# EAGLE design AlimTeleinfoMySensors (EAGLE 7.5.0)
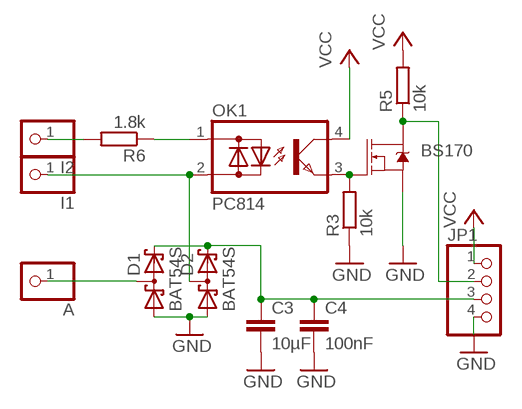
[diagram p0: schematic, sheet 1]

## Parts
A  PINHD-1X1  [1X01]
BS170  MOSFET-NCH-BSS138  [SOT23-3]
C3  10µF  C-EUC1210  [C1210]
C4  100nF  C-EUC1206  [C1206]
D1  BAT54S  [SOT23]
D2  BAT54S  [SOT23]
I1  PINHD-1X1  [1X01]
I2  PINHD-1X1  [1X01]
JP1  PINHD-1X4  [1X04]
OK1  PC814  [DIL04]
R3  10k  R-EU_M1206  [M1206]
R5  10k  R-EU_M1206  [M1206]
R6  1.8k  R-EU_M1206  [M1206]

## Nets
GND: BS170.2(S) C3.2 C4.2 D1.1(A1) D2.1(A1) JP1.4 R3.1
N$8: I2.1 R6.2
N$9: D2.3(C1A2) I1.1 OK1.2(AC2)
N$10: BS170.3(D) JP1.2 R5.1
N$11: C3.1 C4.1 D1.2(C2) D2.2(C2) JP1.3
N$13: OK1.1(AC1) R6.1
N$14: BS170.1(G) OK1.3(E) R3.2
N$15: A.1 D1.3(C1A2)
VCC: JP1.1 OK1.4(C) R5.2

## Library data of the parts
A I1 I2 = pinhead:PINHD-1X1: PIN HEADER
BS170 = SparkFun-DiscreteSemi:MOSFET-NCH: N-channel MOSFETs Voltage controlled devices that allow control of high current outputs. SparkFun Products: SparkFun OpenScale <https://www.sparkfun.com/products/13261> SparkFun Digital Sandbox <https://www.sparkfun.com/products/12651> SparkFun Monster Moto Shield <https://www.sparkfun.com/products/10182> SparkFun MOSFET Power Controller <https://www.sparkfun.com/products/11214>; PROD_ID: TRANS-00830; VALUE: 220mA/50V/3.5Ω
C3 C4 = rcl:C-EU: CAPACITOR, European symbol
D1 D2 = diode:BAT54S: Schottky Diodes Pin connection corrected 2011-05-04 Source: Fairchild .. BAT54.pdf
JP1 = pinhead:PINHD-1X4: PIN HEADER
OK1 = optocoupler:PC814: SHARP OPTO COUPLER; OC_FARNELL: 9707662; OC_NEWARK: unknown
R3 R5 R6 = rcl:R-EU_: RESISTOR, European symbol

## Board
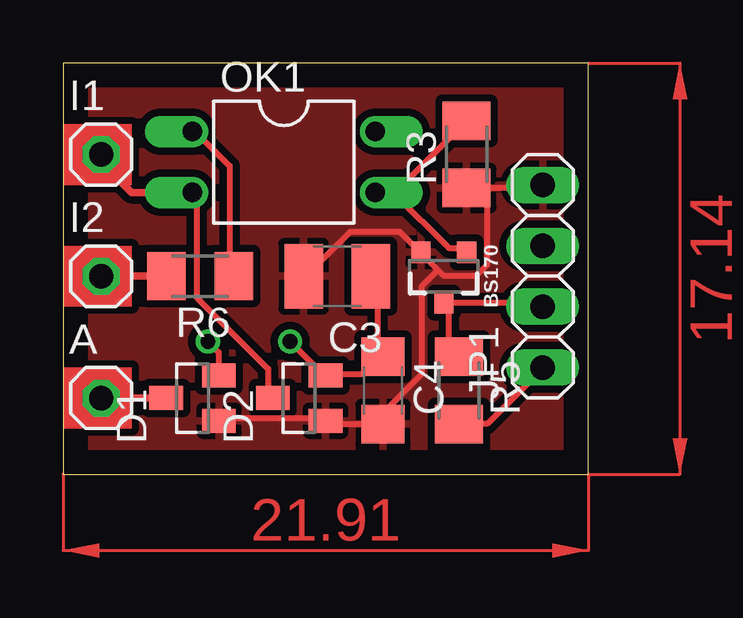
[diagram p1: board, top side]
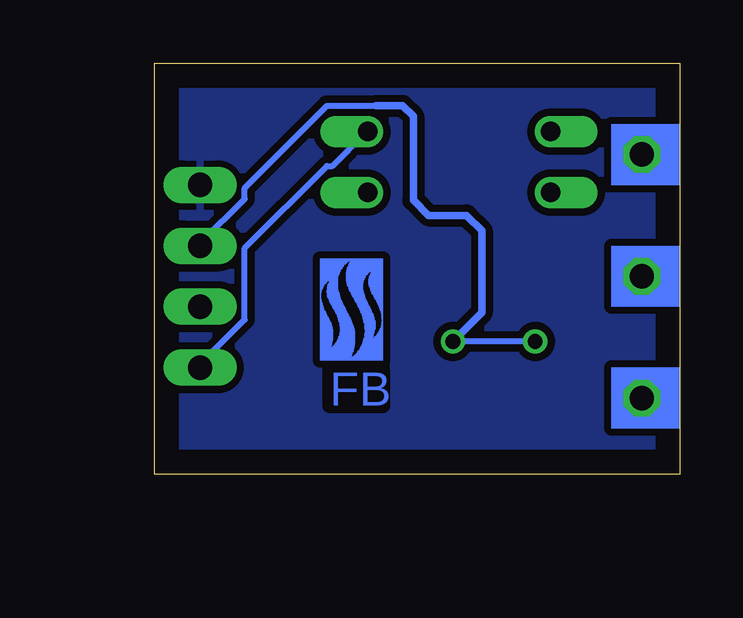
[diagram p2: board, bottom side, seen from below]

Size 21.89 x 17.13 mm. Coordinates in mm from the lower left corner, seen from the top.
Outline: 0,0 21.9,0 21.9,17.13 0,17.13 0,0
Copper layers (1*16): Top 0.035mm / dielectric 1.5mm / Bottom 0.035mm
Design rules "default": minimum track width 10mil, minimum drill 24mil, track to track 8mil, track to pad 8mil, pad to pad 8mil, via to via 8mil, smd to smd 8mil, copper to edge 40mil, drill to drill 8mil, minimum pad ring 10mil, minimum via ring 8mil, stop-mask expansion 4mil, vias tented up to drill 0mil, thermal gap 10mil

### Footprints (pad centres in the part's own frame; a part is rotated, then mirrored left to right if it is on the bottom)
1X01 = drill 1.016 octagon: 1 0,0
SOT23-3 = smd 0.8 x 0.9: 1 -0.95,-1; 2 0.95,-1; 3 0,1.1
C1210 = smd 1.6 x 2.7: 1 -1.4,0; 2 1.4,0
C1206 = smd 1.6 x 1.8: 1 -1.4,0; 2 1.4,0
SOT23 = smd 1 x 1.4: 1 -0.95,-1.1; 2 0.95,-1.1; 3 0,1.1
1X04 = drill 1.016 long: 1 -3.81,0; 2 -1.27,0; 3 1.27,0; 4 3.81,0
DIL04 = drill 0.813 offset: 1 -1.27,-3.81; 2 1.27,-3.81; 3 1.27,3.81; 4 -1.27,3.81
M1206 = smd 1.6 x 2: 1 -1.4,0; 2 1.4,0

### Placement (x,y rotation side)
A  1.59,3.17 0 top
BS170  15.88,8.26 180 top
C3  11.43,8.26 180 top
C4  13.34,3.49 270 top
D1  5.4,3.17 90 top
D2  9.84,3.17 90 top
I1  1.59,13.34 0 top
I2  1.59,8.26 0 top
JP1  20,8.26 90 top
OK1  9.21,13.02 270 top
R3  16.83,13.34 90 top
R5  16.51,3.49 270 top
R6  5.71,8.26 180 top
U$1  [FB]  12.38,4.76 0 top

### Tracks (layer width: path | path; a pad name or v marks a point on that pad's centre or on a via)
GND
  Top 0.254: D1.1 6.72,2.34 10.83,2.34 D2.1 11.06,2.11 13.12,2.11 C4.2 13.35,2.11 13.35,2.57 14.95,4.17 14.95,7.82 15.63,8.51 | 17.69,11.94 19.98,11.94 JP1.4 | 17.69,11.94 17.01,11.94 R3.1 17.69,11.94 | C3.2 10.15,8.28 11.98,10.11 14.03,10.11 14.72,9.42 BS170.2 14.95,9.2 15.63,8.51 | 17.69,11.94 17.69,8.74 17.23,8.28 15.86,8.28 15.63,8.51
  pour Bottom (isolate 0.305): 0,17.14 21.91,17.14 21.91,0 0,0
  pour Top (isolate 0.305): 0,17.14 21.91,17.14 21.91,0 0,0
N$8
  Top 0.305: I2.1 R6.2
N$9
  Top 0.254: D2.3 8.55,3.25 8.55,4.39 5.58,7.37 5.58,11.71 OK1.2
  Top 0.305: I1.1 1.59,13.02 2.86,11.75 OK1.2
N$10
  Top 0.254: 16.09,7.14 16.09,5.31 16.32,5.08 R5.1 | 16.09,7.14 19.98,7.14 JP1.2 | 16.09,7.14 BS170.3
N$11  (via drill 0.61)
  Top 0.254: C3.1 12.89,8.05 13.12,7.82 13.12,5.08 C4.1 13.12,4.85 12.43,4.17 11.06,4.17 D2.2 10.83,4.17 v9.46,5.54 | v6.03,5.54 6.49,5.08 6.49,4.17 D1.2
  Bottom 0.254: 12.66,15.37 14.72,15.37 18.15,11.94 18.15,11.48 19.98,9.65 JP1.3 | v6.03,5.54 v9.46,5.54
  Bottom 0.305: 12.66,15.37 11.56,15.37 11.11,14.92 11.11,11.43 10.48,10.79 8.89,10.79 8.26,10.16 8.26,6.74 v9.46,5.54
N$13
  Top 0.254: R6.1 6.95,8.28 6.95,12.85 5.58,14.22 OK1.1
N$14
  Top 0.254: 13.8,11.71 16.09,9.42 16.78,9.42 BS170.1 | 13.8,11.71 13.12,11.71 OK1.3 13.8,11.71 | 13.8,11.71 16.78,14.68 R3.2
N$15
  Top 0.305: A.1 D1.3
VCC
  Top 0.254: R5.2 16.55,2.11 17.69,2.11 19.98,4.39 JP1.1
  Bottom 0.254: OK1.4 13.12,14.22 14.49,12.85 14.72,12.85 18.15,9.42 18.15,6.45 19.98,4.62 JP1.1
(copper drawn outside any net)
  shapes: Bottom area x3, Top area x5

### Text on the board
Bottom: FB